# EAGLE design RevisionA (EAGLE 9.1.3)

## Sheet 1 of 2
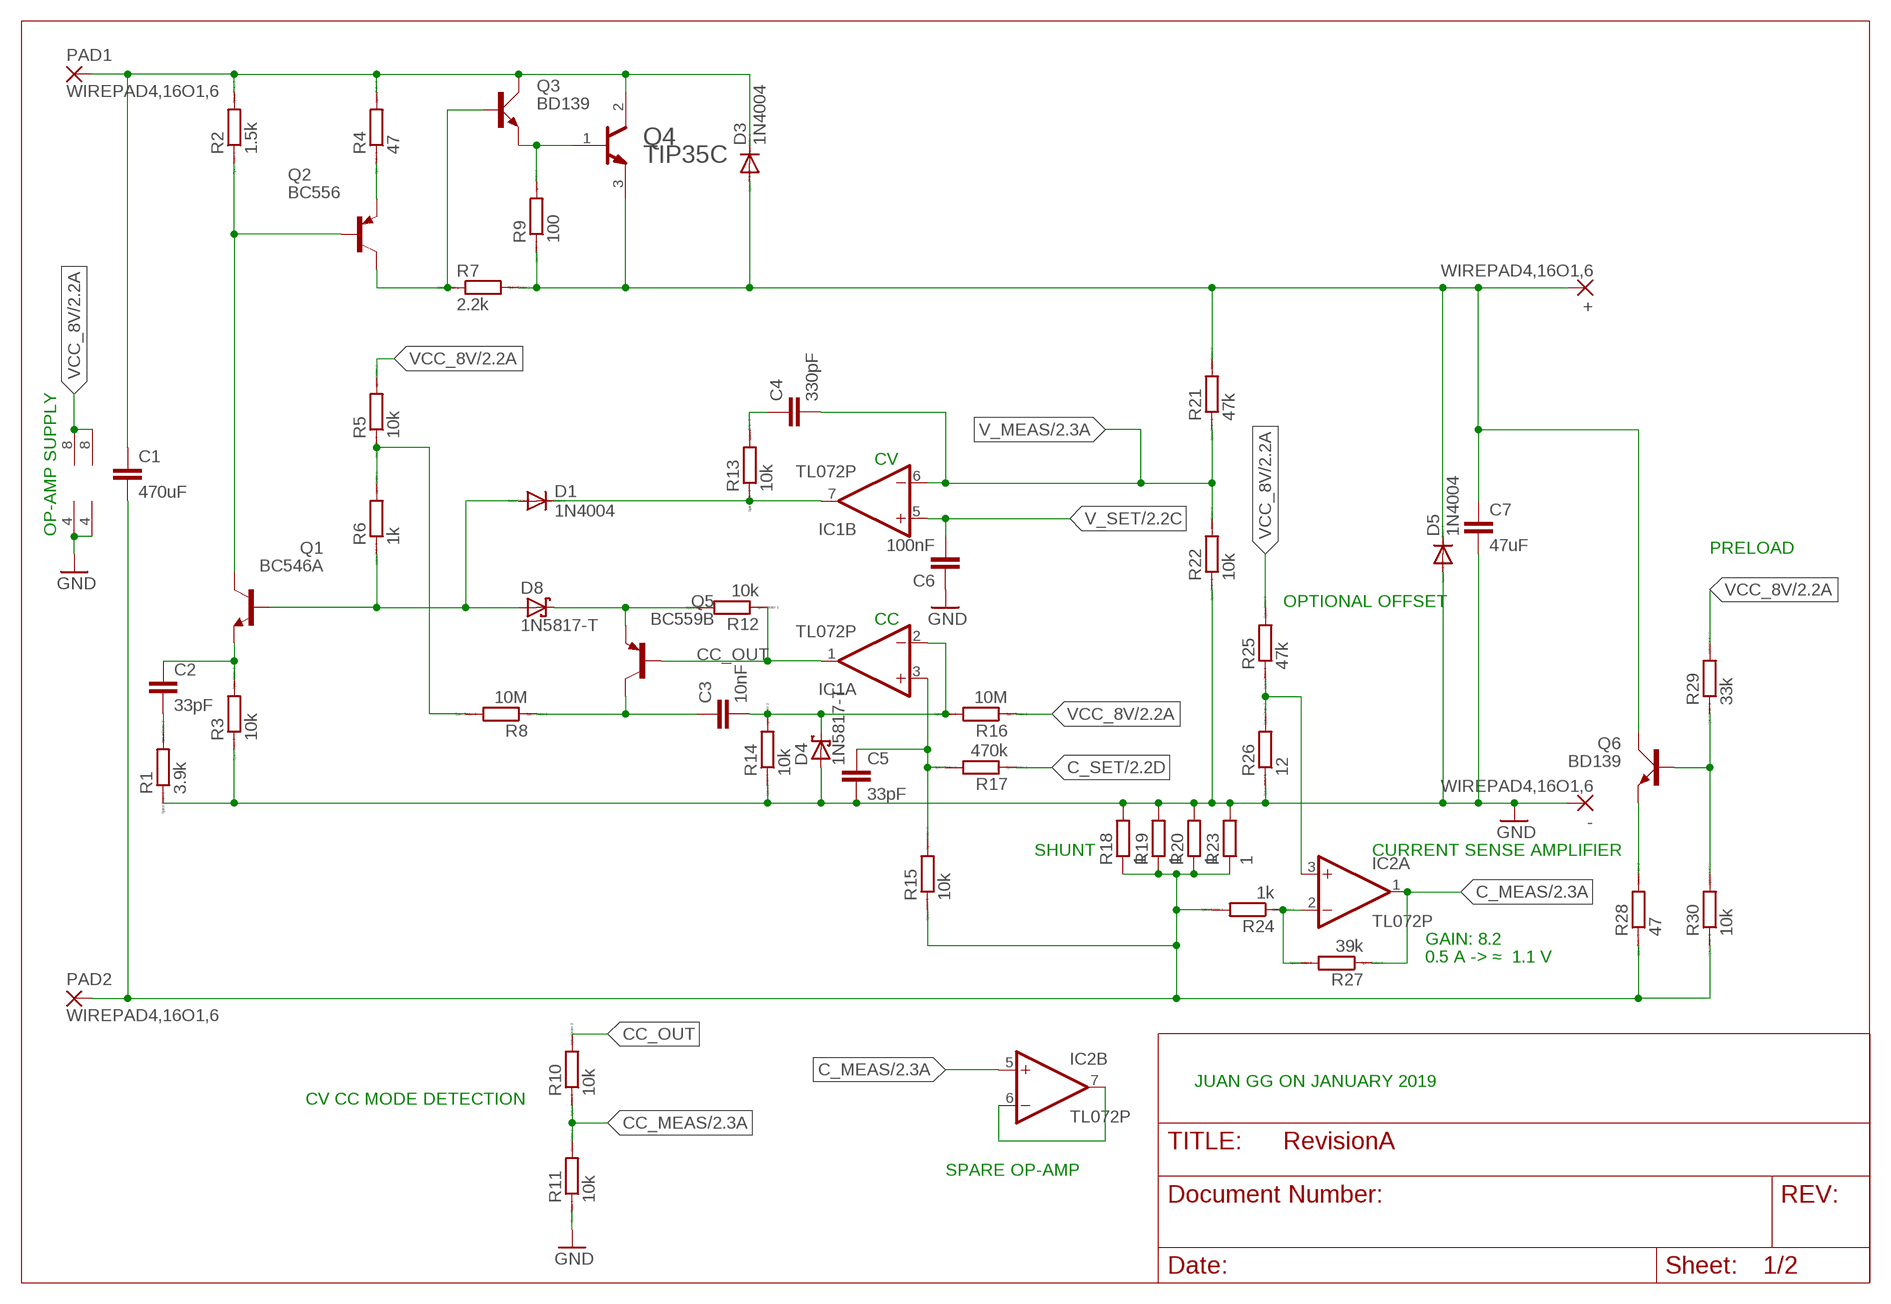
[diagram p0: schematic, sheet 1]

### Parts
+  WIREPAD4,16O1,6  [4,16O1,6]
-  WIREPAD4,16O1,6  [4,16O1,6]
C1  470uF  C5/7.2  [C5B7.2]
C2  33pF  C2.5/2  [C2.5-2]
C3  10nF  C2.5/2  [C2.5-2]
C4  330pF  C2.5/2  [C2.5-2]
C5  33pF  C2.5/2  [C2.5-2]
C6  100nF  C2.5/2  [C2.5-2]
C7  47uF  C5/7.2  [C5B7.2]
D1  1N4004  [DO41-10]
D3  1N4004  [DO41-10]
D4  1N5817-T  [DO41-7.6]
D5  1N4004  [DO41-10]
D8  1N5817-T  [DO41-7.6]
IC1  TL072P  [DIL08]
IC2  TL072P  [DIL08]
PAD1  WIREPAD4,16O1,6  [4,16O1,6]
PAD2  WIREPAD4,16O1,6  [4,16O1,6]
Q1  BC546A  [TO92-EBC]
Q2  BC556  [TO92-EBC]
Q3  BD139  [TO126AV]
Q4  STMICROELECTRONICS_TIP35CSTMICROELECTRONICS_TIP35C_0_0  [STMICROELECTRONICS_TIP35C_0]
Q5  BC559B  [TO92-EBC]
Q6  BD139  [TO126AV]
R1  3.9k  R0207/10  [0207/10]
R2  1.5k  R0207/10  [0207/10]
R3  10k  R0207/10  [0207/10]
R4  47  R0207/10  [0207/10]
R5  10k  R0207/10  [0207/10]
R6  1k  R0207/10  [0207/10]
R7  2.2k  R0207/10  [0207/10]
R8  10M  R0207/10  [0207/10]
R9  100  R0207/10  [0207/10]
R10  10k  R0207/10  [0207/10]
R11  10k  R0207/10  [0207/10]
R12  10k  R0207/10  [0207/10]
R13  10k  R0207/10  [0207/10]
R14  10k  R0207/10  [0207/10]
R15  10k  R0207/10  [0207/10]
R16  10M  R0207/10  [0207/10]
R17  470k  R0207/10  [0207/10]
R18  1  R-EU_0617/5V  [0617V]
R19  1  R-EU_0617/5V  [0617V]
R20  1  R-EU_0617/5V  [0617V]
R21  47k  R0207/10  [0207/10]
R22  10k  R0207/10  [0207/10]
R23  1  R-EU_0617/5V  [0617V]
R24  1k  R0207/10  [0207/10]
R25  47k  R0207/10  [0207/10]
R26  12  R0207/10  [0207/10]
R27  39k  R0207/10  [0207/10]
R28  47  R0207/10  [0207/10]
R29  33k  R0207/10  [0207/10]
R30  10k  R0207/10  [0207/10]

### Nets
+UNREG(MAIN) [POWER]: C1.1 D3.C PAD1.1(P) Q3.C Q4.2(COLLECTOR) R2.2 R4.2
-UNREG(MAIN) [POWER]: C1.2 PAD2.1(P) R15.1 R18.1 R19.1 R20.1 R23.1 R24.2 R28.1 R30.1
C_MEAS: IC2.1(A:OUT) IC2.5(B:+IN) R27.1 ; also sheet 2
C_SET: R17.1 ; also sheet 2
CC_MEAS: R10.1 R11.2 ; also sheet 2
CC_OUT: IC1.1(A:OUT) Q5.B R10.2 R12.1
GND: -.1(P) C5.2 C6.1 C7.2 D4.A D5.A IC1.4(P:V-) IC2.4(P:V-) R1.1 R3.1 R11.1 R14.1 R18.2 R19.2 R20.2 R22.1 R23.2 R26.1 ; also sheet 2
N$2: Q3.E Q4.1(BASE) R9.2
N$3 [POWER]: +.1(P) C7.1 D3.A D5.C Q4.3(EMITTER) Q6.C R7.2 R9.1 R21.2
N$4: Q2.C Q3.B R7.1
N$5: Q2.E R4.1
N$6: Q1.C Q2.B R2.1
N$7: R5.1 R6.2 R8.2
N$8: D1.A D8.A Q1.B R6.1
N$9: C2.1 Q1.E R3.2
N$10: C2.2 R1.2
N$12: D8.C Q5.E R12.2
N$13: C3.2 D4.C IC1.2(A:-IN) R14.2 R16.2
N$14: C3.1 Q5.C R8.1
N$17: C5.1 IC1.3(A:+IN) R15.2 R17.2
N$18: D1.C IC1.7(B:OUT) R13.1
N$19: C4.1 R13.2
N$21: Q6.E R28.2
N$22: Q6.B R29.1 R30.2
N$24: IC2.2(A:-IN) R24.1 R27.2
N$25: IC2.6(B:-IN) IC2.7(B:OUT)
N$26: IC2.3(A:+IN) R25.1 R26.2
V_MEAS: C4.2 IC1.6(B:-IN) R21.1 R22.2 ; also sheet 2
V_SET: C6.2 IC1.5(B:+IN) ; also sheet 2
VCC_8V: IC1.8(P:V+) IC2.8(P:V+) R5.2 R16.1 R25.2 R29.2 ; also sheet 2

### Notes on the sheet
- CV
- OP-AMP SUPPLY
- PRELOAD
- OPTIONAL OFFSET
- CC
- SHUNT | CURRENT SENSE AMPLIFIER
- GAIN: 8.2
- 0.5 A -> ≈  1.1 V
- JUAN GG ON JANUARY 2019
- CV CC MODE DETECTION
- SPARE OP-AMP

## Sheet 2 of 2
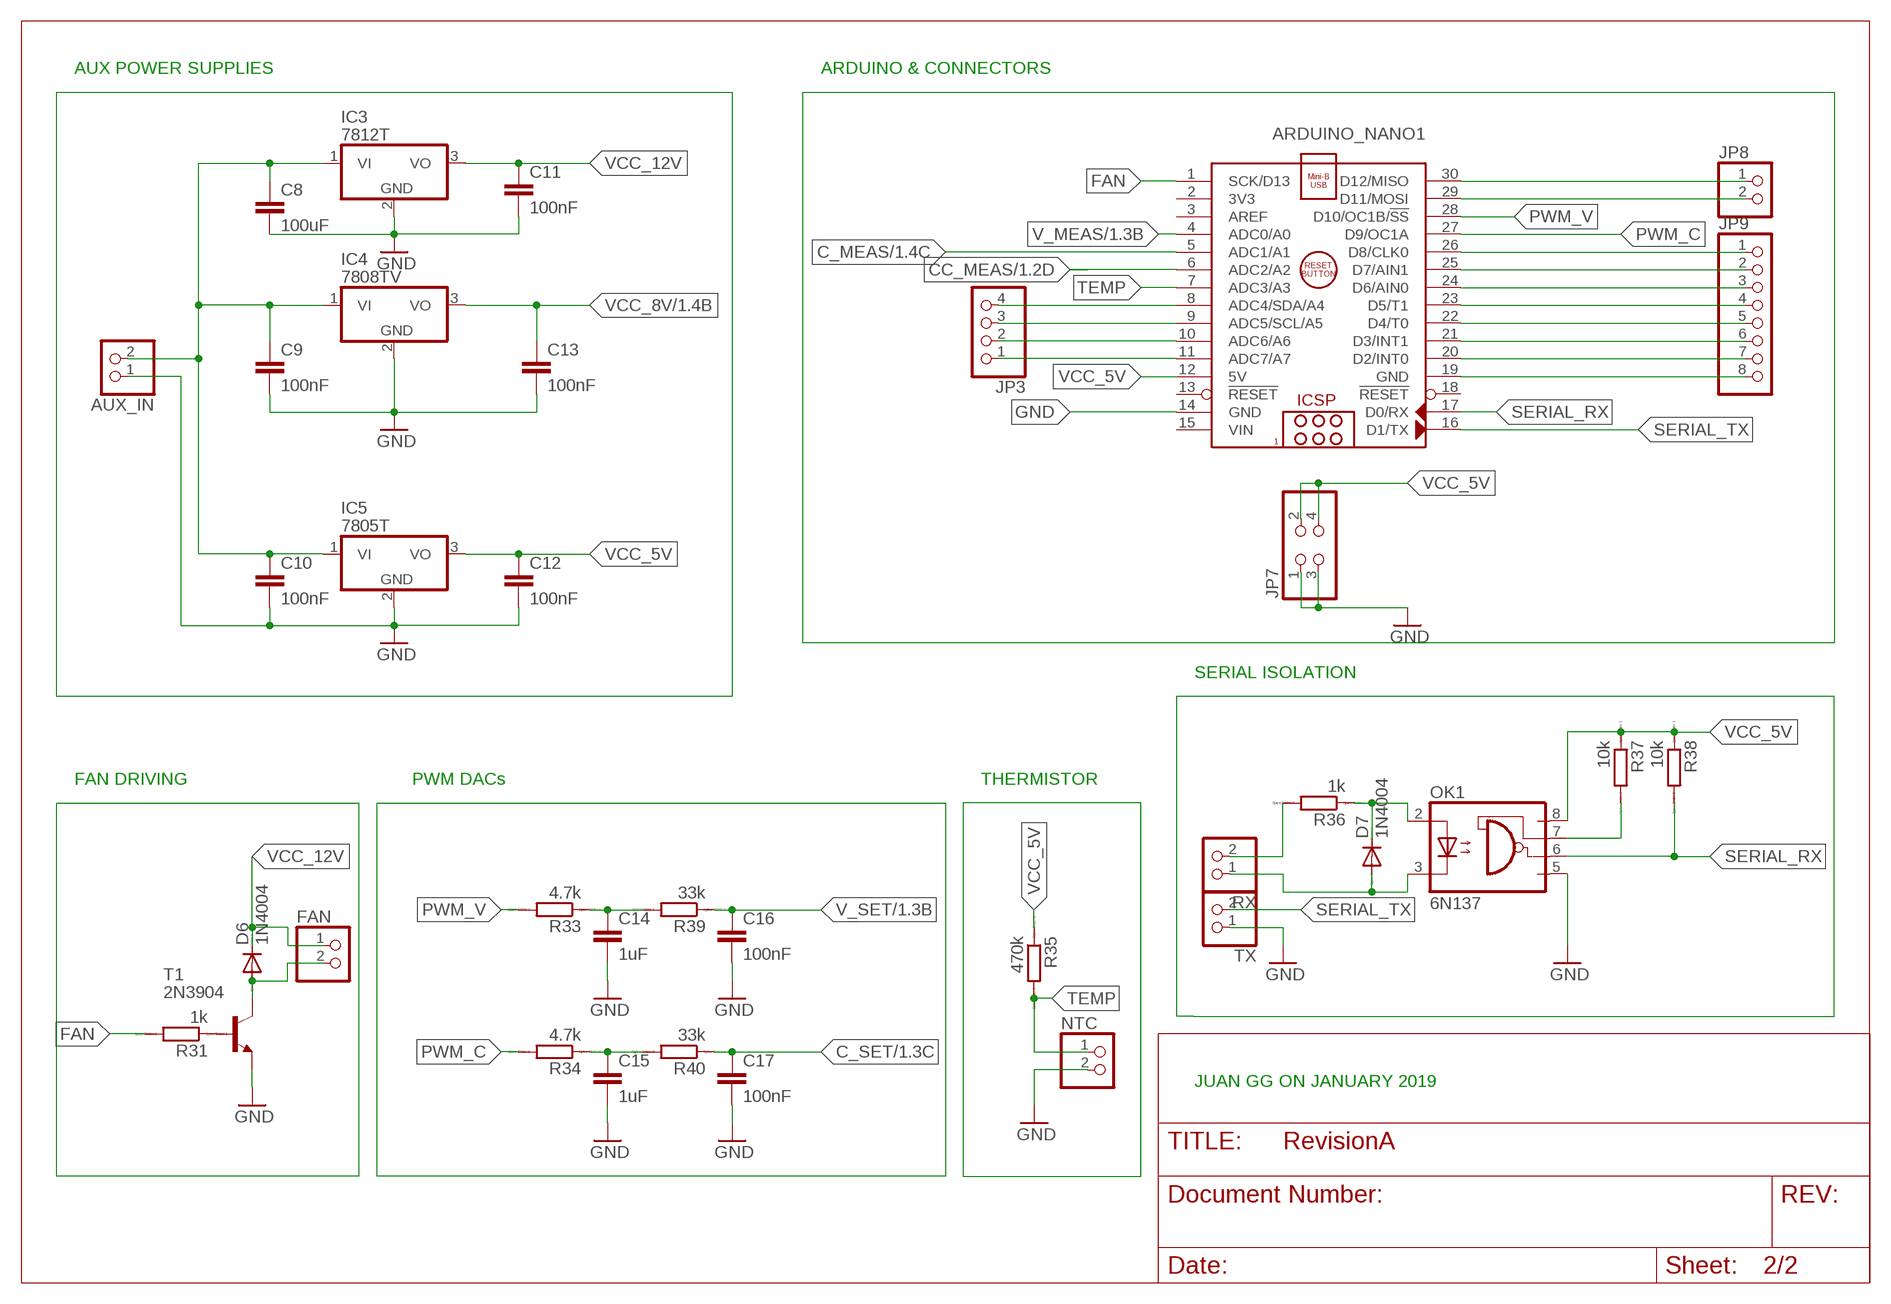
[diagram p1: schematic, sheet 2]
FRAME2 (DINA4_L): TEST: test

### Parts
ARDUINO_NANO1  ARDUINO_NANO  [ARDUINO_NANO]
AUX_IN  PINHD-1X2  [1X02]
C8  100uF  C2.5/4  [C2.5-4]
C9  100nF  C2.5/2  [C2.5-2]
C10  100nF  C2.5/2  [C2.5-2]
C11  100nF  C2.5/2  [C2.5-2]
C12  100nF  C2.5/2  [C2.5-2]
C13  100nF  C2.5/2  [C2.5-2]
C14  1uF  C2.5/4  [C2.5-4]
C15  1uF  C2.5/4  [C2.5-4]
C16  100nF  C2.5/4  [C2.5-4]
C17  100nF  C2.5/4  [C2.5-4]
D6  1N4004  [DO41-10]
D7  1N4004  [DO41-10]
FAN  PINHD-1X2  [1X02]
IC3  7812T  [TO220H]
IC4  7808TV  7812T  [TO220H]
IC5  7805T  [TO220H]
JP3  PINHD-1X4  [1X04]
JP7  PINHD-2X2  [2X02]
JP8  PINHD-1X2  [1X02]
JP9  PINHD-1X8  [1X08]
NTC  PINHD-1X2  [1X02]
OK1  6N137  [DIL08]
R31  1k  R0207/10  [0207/10]
R33  4.7k  R0207/10  [0207/10]
R34  4.7k  R0207/10  [0207/10]
R35  470k  R0207/10  [0207/10]
R36  1k  R0207/10  [0207/10]
R37  10k  R0207/10  [0207/10]
R38  10k  R0207/10  [0207/10]
R39  33k  R0207/10  [0207/10]
R40  33k  R0207/10  [0207/10]
RX  PINHD-1X2  [1X02]
T1  2N3904  [TO92]
TX  PINHD-1X2  [1X02]

### Nets
+UNREG(AUX): AUX_IN.2 C8.1 C9.1 C10.1 IC3.1(VI) IC4.1(VI) IC5.1(VI)
A6: ARDUINO_NANO1.10(ADC6/A6) JP3.2
A7: ARDUINO_NANO1.11(ADC7/A7) JP3.1
C_MEAS: ARDUINO_NANO1.5(ADC1/A1) ; also sheet 1
C_SET: C17.1 R40.1 ; also sheet 1
CC_MEAS: ARDUINO_NANO1.6(ADC2/A2) ; also sheet 1
D2: ARDUINO_NANO1.20(D2/INT0) JP9.7
D3: ARDUINO_NANO1.21(D3/INT1) JP9.6
D4: ARDUINO_NANO1.22(D4/T0) JP9.5
D5: ARDUINO_NANO1.23(D5/T1) JP9.4
D6: ARDUINO_NANO1.24(D6/AIN0) JP9.3
D7: ARDUINO_NANO1.25(D7/AIN1) JP9.2
D8: ARDUINO_NANO1.26(D8/CLK0) JP9.1
D11: ARDUINO_NANO1.29(D11/MOSI) JP8.2
D12: ARDUINO_NANO1.30(D12/MISO) JP8.1
FAN: ARDUINO_NANO1.1(SCK/D13) R31.2
GND: ARDUINO_NANO1.14(GND) ARDUINO_NANO1.19(GND) AUX_IN.1 C8.2 C9.2 C10.2 C11.2 C12.2 C13.2 C14.2 C15.2 C16.2 C17.2 IC3.2(GND) IC4.2(GND) IC5.2(GND) JP7.1 JP7.3 JP9.8 NTC.2 OK1.5(GND) T1.3(E) TX.1 ; also sheet 1
N$1: D7.C OK1.2(A) R36.1
N$11: C14.1 R33.1 R39.2
N$23: OK1.7(VE) R37.2
N$27: D6.A FAN.2 T1.1(C)
N$28: R31.1 T1.2(B)
N$30: C15.1 R34.1 R40.2
N$31: R36.2 RX.2
N$32: D7.A OK1.3(C) RX.1
N$34: ARDUINO_NANO1.8(ADC4/SDA/A4) JP3.4
N$39: ARDUINO_NANO1.9(ADC5/SCL/A5) JP3.3
PWM_C: ARDUINO_NANO1.27(D9/OC1A) R34.2
PWM_V: ARDUINO_NANO1.28(D10/OC1B/!SS) R33.2
SERIAL_RX: ARDUINO_NANO1.17(D0/RX) OK1.6(VO) R38.2
SERIAL_TX: ARDUINO_NANO1.16(D1/TX) TX.2
TEMP: ARDUINO_NANO1.7(ADC3/A3) NTC.1 R35.2
V_MEAS: ARDUINO_NANO1.4(ADC0/A0) ; also sheet 1
V_SET: C16.1 R39.1 ; also sheet 1
VCC_5V: ARDUINO_NANO1.12(5V) C12.1 IC5.3(VO) JP7.2 JP7.4 OK1.8(VCC) R35.1 R37.1 R38.1
VCC_8V: C13.1 IC4.3(VO) ; also sheet 1
VCC_12V: C11.1 D6.C FAN.1 IC3.3(VO)
Unconnected: ARDUINO_NANO1.2(3V3) ARDUINO_NANO1.3(AREF) ARDUINO_NANO1.13(!RESET) ARDUINO_NANO1.18(!RESET)

### Notes on the sheet
- AUX POWER SUPPLIES | ARDUINO & CONNECTORS
- SERIAL ISOLATION
- FAN DRIVING | PWM DACs | THERMISTOR
- JUAN GG ON JANUARY 2019

## Power pins joined to a net without a drawn wire
VIN: ARDUINO_NANO1.15(VIN)

## Library data of the parts
+ - PAD1 PAD2 = wirepad:WIREPAD: Wire PAD connect wire on PCB
ARDUINO_NANO1 = ArduinoNanoV30:ARDUINO_NANO: Arduino Nano V3.0 Module Overview: The Arduino Nano is a small, complete, and breadboard-friendly board based on the ATmega328 (Arduino Nano 3.x) or ATmega168 (Arduino Nano 2.x). It has more or less the same functionality of the Arduino Duemilanove, but in a different package. It lacks only a DC power jack, and works with a Mini-B USB cable instead of a standard one. The Nano was designed and is being produced by Gravitech <http://www.gravitech.us/arna30wiatp.html>. General specifications: Item Value Microcontroller Atmel ATmega168 or ATmega328 Operating Voltage (logic level) 5 V Input Voltage (recommended) 7-12 V Input Voltage (limits) 6-20 V Digital I/O Pins 14 (of which 6 provide PWM output) Analog Input Pins 8 DC Current per I/O Pin 40 mA Flash Memory 16 KB (ATmega168) or 32 KB (ATmega328) of which 2 KB used by bootloader SRAM 1 KB (ATmega168) or 2 KB (ATmega328) EEPROM 512 bytes (ATmega168) or 1 KB (ATmega328) Clock Speed 16 MHz Dimensions (Inches) 0.73" x 1.70" Dimensions (mm) 18mm x 45mm Overall height About 9 mm (not including pins) Weigth 5 g Power: The Arduino Nano can be powered via the Mini-B USB connection, 6-20V unregulated external power supply (pin 30), or 5V regulated external power supply (pin 27). The power source is automatically selected to the highest voltage source. Memory: The ATmega168 has 16 KB of flash memory for storing code (of which 2 KB is used for the bootloader); the ATmega328 has 32 KB, (also with 2 KB used for the bootloader). The ATmega168 has 1 KB of SRAM and 512 bytes of EEPROM (which can be read and written with the EEPROM library); the ATmega328 has 2 KB of SRAM and 1 KB of EEPROM. Input and Output: Each of the 14 digital pins on the Nano can be used as an input or output, using pinMode(), digitalWrite(), and digitalRead() functions. They operate at 5 volts. Each pin can provide or receive a maximum of 40 mA and has an internal pull-up resistor (disconnected by default) of 20-50 kOhms. In addition, some pins have specialized functions. Visit Arduino - ArduinoBoardNano <https://www.arduino.cc/en/Main/ArduinoBoardNano>
AUX_IN FAN JP8 NTC RX TX = pinhead:PINHD-1X2: PIN HEADER
C1-C17 = capacitor-wima:C: CAPACITOR naming: grid - package width
D1 D3 D5-D7 = diode:1N4004: DIODE general purpose rectifier, 1 A
D4 D8 = diode:1N581*: 1.0A SCHOTTKY BARRIER RECTIFIER Source: http://www.diodes.com/datasheets/ds23001.pdf
IC1 IC2 = linear:TL072: OP AMP
IC3-IC5 = linear:78*: Positive VOLTAGE REGULATOR Source: http://cache.national.com/ds/LM/LM78L05.pdf http://www.fairchildsemi.com/ds/LM/LM7805.pdf
JP3 = pinhead:PINHD-1X4: PIN HEADER
JP7 = pinhead:PINHD-2X2: PIN HEADER
JP9 = pinhead:PINHD-1X8: PIN HEADER
OK1 = optocoupler:6N137: MOTOROLA OPTO COUPLER; MPN: 6N137; OC_FARNELL: 1328376; OC_NEWARK: 52M1895
Q1 = transistor-npn:BC546*: NPN Transistor
Q2 = transistor-pnp:BC556*: PNP Transistror
Q3 Q6 = transistor-power:BD139: NPN TRANSISTOR
Q4 = TIP35C:STMICROELECTRONICS_TIP35C: Complementary power transistors; CENTROID_NOT_SPECIFIED: No; DATASHEET: http://www.st.com/content/ccc/resource/technical/document/datasheet/81/78/4f/8c/28/81/4d/c1/CD00001165.pdf/files/CD00001165.pdf/jcr:content/translations/en.CD00001165.pdf; DIGIKEY_DESCRIPTION: TRANS NPN 100V 25A TO-247; DIGIKEY_PART_NUMBER: 497-2609-5-ND; IPC_LAND_PATTERN_NAME: TO-220; LEAD_FREE: yes; MF: STMicroelectronics; MOUSER_PART_NUMBER: 511-TIP35C; MPN: TIP35C; PACKAGE: TO247; PREFIX: Q; ROHS: yes; TEMPERATURE_RANGE_HIGH: +150°C; VOLTAGE: 100V
Q5 = transistor-pnp:BC559*: PNP Transistror
R1-R17 R21 R22 R24-R31 R33-R40 = eagle-ltspice:R: RESISTOR, European symbol; SPICEMODEL: NONE; SPICEPREFIX: R
R18-R20 R23 = resistor:R-EU_: RESISTOR, European symbol
T1 = transistor:2N3904: NPN TRANSISTOR

## Net classes
1 POWER: clearance 0.508 mm

## Board
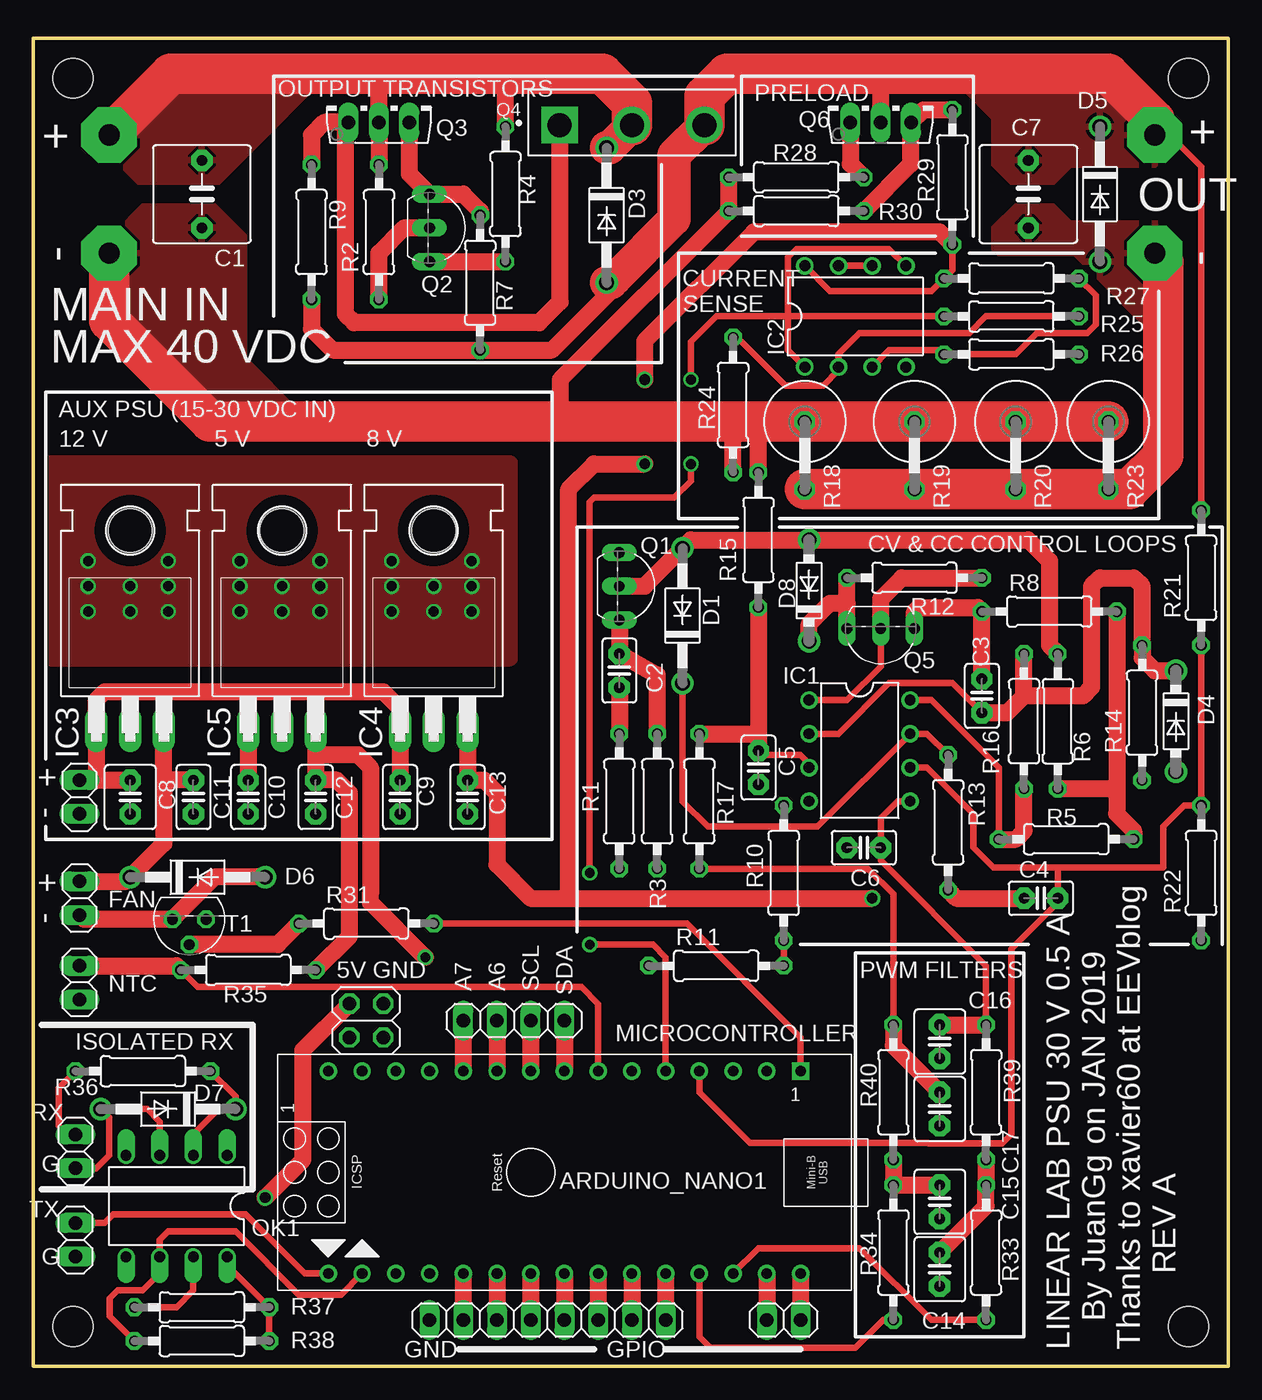
[diagram p2: board, top side]
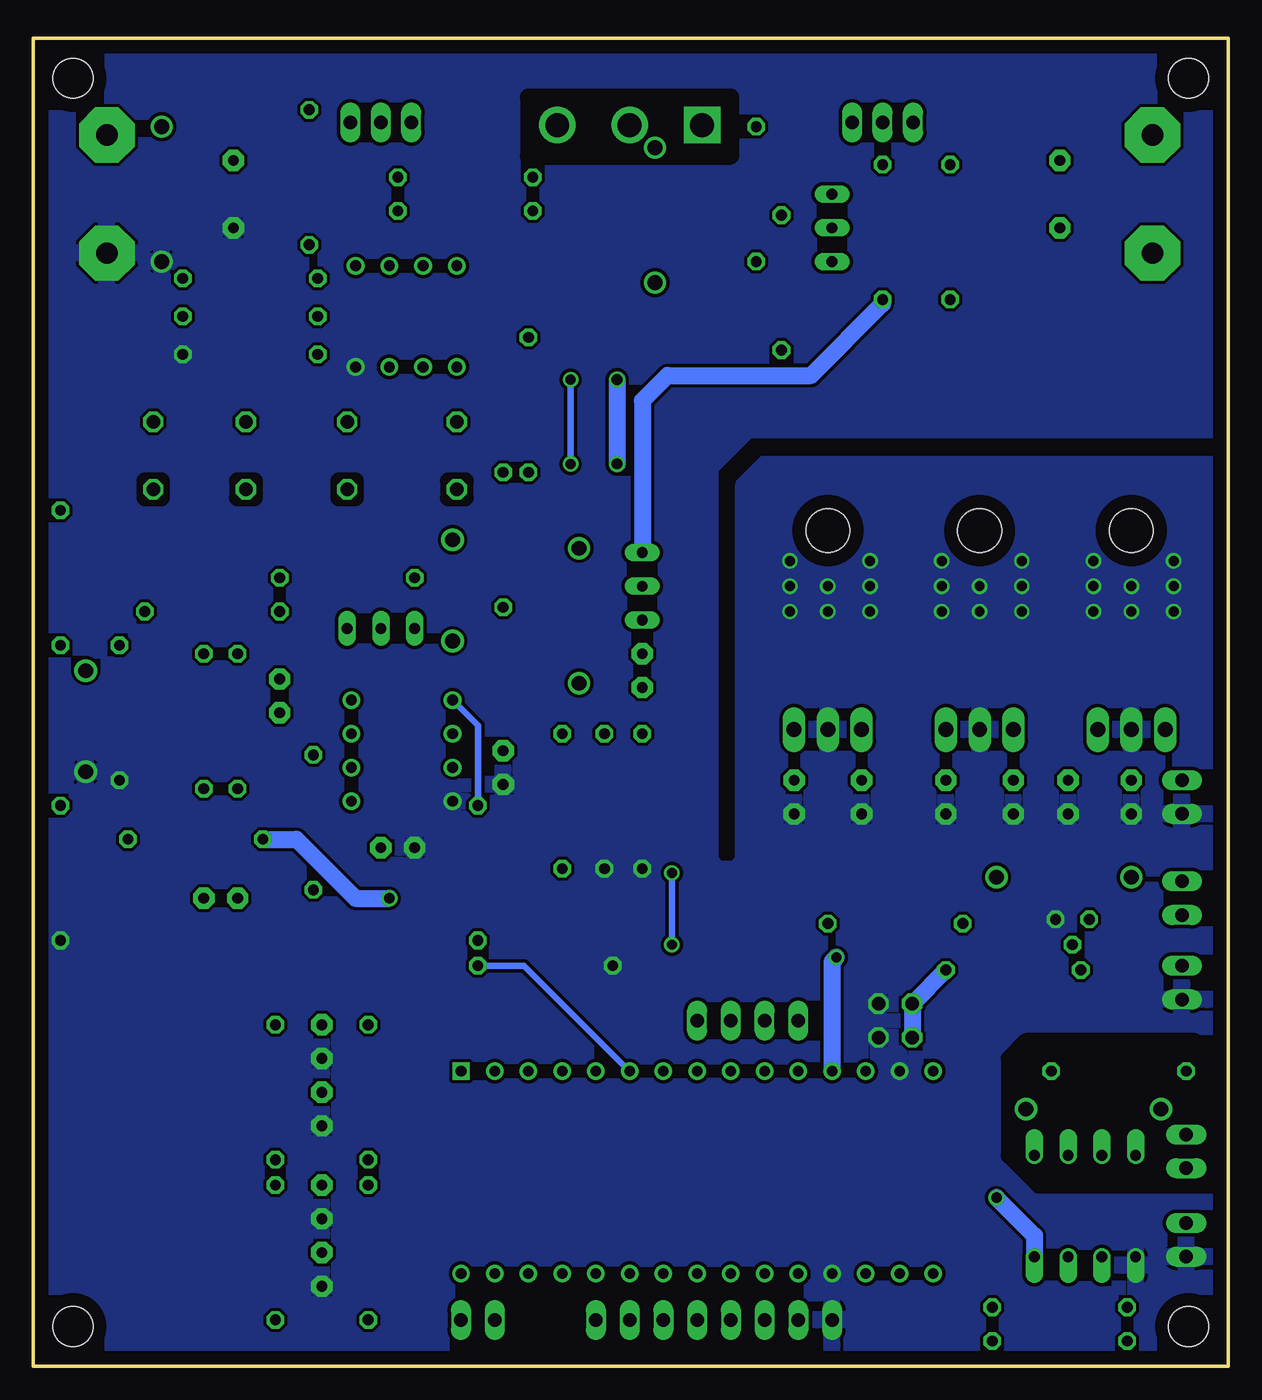
[diagram p3: board, bottom side, seen from below]

Size 90 x 100 mm. Coordinates in mm from the lower left corner, seen from the top.
Outline: 0,100 0,0 90,0 90,100 0,100
Copper layers (1*16): Top 0.035mm / dielectric 1.5mm / Bottom 0.035mm
Design rules "default *": minimum track width 6mil, minimum drill 0.35mm, track to track 10mil, track to pad 10mil, pad to pad 10mil, via to via 10mil, smd to smd 6mil, copper to edge 40mil, drill to drill 6mil, minimum pad ring 10mil, minimum via ring 8mil, stop-mask expansion 4mil, vias tented up to drill 0mil, thermal gap 10mil
Holes 3 mm at 3,3 87,3 87,97 3,97
bRestrict: area 37.5,91.1 to 52.7,95.6; area 57.5,65.4 to 58.7,66.7; area 65.7,65.4 to 67,66.7; area 73.3,65.4 to 74.6,66.7; area 80.3,65.4 to 81.6,66.7; area 1.9,13.7 to 16.5,24.4

### Footprints (pad centres in the part's own frame; a part is rotated, then mirrored left to right if it is on the bottom)
4,16O1,6 = drill 1.6 pad 4.166 octagon: 1 0,0
ARDUINO_NANO = drill 0.8 square: 1 -20.32,-7.62 | drill 0.8: 2 -17.78,-7.62; 3 -15.24,-7.62; 4 -12.7,-7.62; 5 -10.16,-7.62; 6 -7.62,-7.62; 7 -5.08,-7.62; 8 -2.54,-7.62; 9 0,-7.62; 10 2.54,-7.62; 11 5.08,-7.62; 12 7.62,-7.62; 13 10.16,-7.62; 14 12.7,-7.62; 15 15.24,-7.62; 16 15.24,7.62; 17 12.7,7.62; 18 10.16,7.62; 19 7.62,7.62; 20 5.08,7.62; 21 2.54,7.62; 22 0,7.62; 23 -2.54,7.62; 24 -5.08,7.62; 25 -7.62,7.62; 26 -10.16,7.62; 27 -12.7,7.62; 28 -15.24,7.62; 29 -17.78,7.62; 30 -20.32,7.62
1X02 = drill 1.016 long: 1 -1.27,0; 2 1.27,0
C5B7.2 = drill 0.813 pad 1.6 octagon: 1 -2.54,0; 2 2.54,0
C2.5-2 = drill 0.813 pad 1.6 octagon: 1 -1.27,0; 2 1.27,0
C2.5-4 = drill 0.813 pad 1.6 octagon: 1 -1.27,0; 2 1.27,0
DO41-10 = drill 1.118: A 5.08,0; C -5.08,0
DO41-7.6 = drill 1.1 pad 1.7: A 3.81,0; C -3.81,0
DIL08 = drill 0.813 pad 1.27: 1 -3.81,-3.81; 2 -1.27,-3.81; 3 1.27,-3.81; 4 3.81,-3.81; 5 3.81,3.81; 6 1.27,3.81; 7 -1.27,3.81; 8 -3.81,3.81
TO220H = drill 1.118 long: 1 -2.54,-10.16; 2 0,-10.16; 3 2.54,-10.16 | hole 3.302: 0,4.826
1X04 = drill 1.016 long: 1 -3.81,0; 2 -1.27,0; 3 1.27,0; 4 3.81,0
2X02 = drill 1.016 octagon: 1 -1.27,-1.27; 2 -1.27,1.27; 3 1.27,-1.27; 4 1.27,1.27
1X08 = drill 1.016 long: 1 -8.89,0; 2 -6.35,0; 3 -3.81,0; 4 -1.27,0; 5 1.27,0; 6 3.81,0; 7 6.35,0; 8 8.89,0
DIL08' = drill 0.813 offset: 1 -3.81,-3.81; 2 -1.27,-3.81; 3 1.27,-3.81; 4 3.81,-3.81; 5 3.81,3.81; 6 1.27,3.81; 7 -1.27,3.81; 8 -3.81,3.81
TO92-EBC = drill 0.813 long: B 0,-1.27; C -2.54,-1.27; E 2.54,-1.27
TO126AV = drill 1.016 long: B 2.286,-1.27; C 0,-1.27; E -2.286,-1.27
STMICROELECTRONICS_TIP35C_0 = drill 1.8 pad 2.75 square: 1 -0.2,5.45 | drill 1.8 pad 2.75: 2 -0.2,0; 3 -0.2,-5.45
0207/10 = drill 0.813 octagon: 1 -5.08,0; 2 5.08,0
0617V = drill 1.016 octagon: 1 -2.54,0; 2 2.54,0
TO92 = drill 0.813 octagon: 1 1.27,0; 2 0,1.905; 3 -1.27,0

### Placement (x,y rotation side)
+  84.45,92.71 0 top
-  84.45,83.82 0 top
ARDUINO_NANO1  37.47,14.61 180 top
AUX_IN  3.49,42.86 90 top
C1  12.7,88.27 270 top
C2  44.13,52.39 270 top
C3  71.44,50.48 270 top
C4  75.88,35.24 0 top
C5  54.61,45.09 270 top
C6  62.55,39.05 0 top
C7  74.93,88.27 270 top
C8  7.3,42.86 270 top
C9  27.62,42.86 270 top
C10  16.19,42.86 270 top
C11  12.06,42.86 270 top
C12  21.27,42.86 270 top
C13  32.7,42.86 270 top
C14  68.26,7.3 270 top
C15  68.26,12.38 270 top
C16  68.26,24.45 270 top
C17  68.26,19.37 270 top
D1  48.9,56.52 90 top
D3  43.18,86.68 270 top
D4  86.04,48.58 270 top
D5  80.33,88.27 270 top
D6  12.38,36.83 0 top
D7  10.16,19.37 180 top
D8  58.42,58.42 90 top
FAN  3.49,35.24 270 top
IC1  62.23,46.35 270 top
IC2  61.91,79.06 0 top
IC3  7.3,58.1 0 top
IC4  30.16,58.1 0 top
IC5  18.73,58.1 0 top
JP3  36.2,26.04 0 top
JP7  25.08,26.04 90 top
JP8  56.52,3.49 180 top
JP9  38.73,3.49 180 top
NTC  3.49,28.89 270 top
OK1  6N137  [DIL08']  10.79,12.06 180 top
PAD1  5.71,92.71 0 top
PAD2  5.71,83.82 0 top
Q1  45.4,58.74 270 top
Q2  31.11,85.72 270 top
Q3  26.04,94.93 0 top
Q4  45.09,93.66 90 top
Q5  63.82,54.29 180 top
Q6  63.82,94.93 0 top
R1  44.13,42.55 90 top
R2  26.04,85.41 90 top
R3  46.99,42.55 90 top
R4  35.56,88.27 90 top
R5  77.79,39.69 180 top
R6  77.15,48.58 270 top
R7  33.66,81.6 270 top
R8  76.52,56.83 0 top
R9  20.95,85.41 90 top
R10  56.52,37.15 90 top
R11  51.44,30.16 0 top
R12  66.36,59.37 180 top
R13  68.9,40.96 270 top
R14  83.5,49.21 90 top
R15  54.61,62.23 270 top
R16  74.61,48.58 90 top
R17  50.16,42.55 90 top
R18  58.1,68.58 270 top
R19  66.36,68.58 270 top
R20  73.98,68.58 270 top
R21  87.95,59.37 90 top
R22  87.95,37.15 90 top
R23  80.96,68.58 270 top
R24  52.7,72.39 270 top
R25  73.66,81.92 180 top
R26  73.66,76.2 180 top
R27  73.66,79.06 0 top
R28  57.47,89.53 0 top
R29  69.22,89.53 270 top
R30  57.47,87 0 top
R31  25.08,33.34 0 top
R33  71.75,8.57 270 top
R34  64.77,8.57 270 top
R35  16.19,29.84 180 top
R36  8.26,22.23 180 top
R37  12.7,4.45 180 top
R38  12.7,1.91 180 top
R39  71.75,20.64 270 top
R40  64.77,20.64 270 top
RX  3.17,16.19 90 top
T1  11.75,33.66 180 top
TX  3.17,9.53 90 top

### Tracks (layer width: path | path; a pad name or v marks a point on that pad's centre or on a via)
+UNREG(AUX)
  Top 1.27: 16.19,50.8 5.4,50.8 4.76,50.16 IC3.1 4.76,44.13 AUX_IN.2 C8.1 | 16.19,50.8 26.35,50.8 27.62,49.53 IC4.1 C9.1 | C10.1 IC5.1 16.19,50.8
+UNREG(MAIN)
  Top 1.27: R2.2 Q3.C 26.04,97.33 | R4.2 35.56,97.02 35.88,97.33
  Top 2.54: D3.C 43.38,91.76 Q4.2
  Top 3.048: PAD1.1 10.34,97.33 26.04,97.33 35.88,97.33 42.86,97.33 45.09,95.11 Q4.2
  pour Top: 20.32,96.2 11.11,96.2 10.79,96.2
  pour Top: 5.71,92.71 5.71,91.44 7.62,89.53 7.94,89.22 13.97,89.22 15.88,91.12 22.23,97.47 11.75,97.47 11.43,97.79 6.35,92.71
-UNREG(MAIN)
  Top 1.27: R28.1 R30.1 39.69,74.3 39.69,71.12 | 55.56,71.12 54.61,71.12 R15.1 | R24.2 52.7,71.12
  Top 3.048: R23.1 R20.1 R19.1 R18.1 55.56,71.12 52.7,71.12 39.69,71.12 13.34,71.12 5.71,78.74 PAD2.1
  pour Top: 6.35,85.41 8.26,87.31 13.65,87.31 15.88,85.09 15.88,75.88 20,71.75 20,71.44 13.65,71.44 5.71,79.38 5.71,81.28 5.71,84.77
A6
  Top 1.27: JP3.2 ARDUINO_NANO1.10
A7
  Top 1.27: JP3.1 ARDUINO_NANO1.11
C_MEAS  (via drill 0.75)
  Top 0.508: R27.1 56.83,79.06 | 56.83,79.06 56.83,79.38 56.83,83.5 57.47,84.14 64.45,84.14 IC2.5 | v49.53,74.3 49.53,77.15 51.44,79.06 56.83,79.06 | IC2.1 56.83,76.52 56.83,79.06 | v41.91,37.15 41.91,65.09 42.23,65.41 48.26,65.41 49.53,66.67 v49.53,67.94 | v41.91,31.75 46.67,31.75 47.62,30.8 ARDUINO_NANO1.5
  Bottom 0.508: v41.91,37.15 v41.91,31.75 | v49.53,74.3 v49.53,67.94
C_SET
  Top 0.508: R17.1 62.87,37.47 64.77,35.56 64.77,26.04 R40.1
  Top 1.27: R40.1 64.77,24.13 C17.1
CC_MEAS
  Top 0.508: R10.1 R11.2
  Bottom 0.508: ARDUINO_NANO1.6 53.02,30.16 R11.2
CC_OUT
  Top 0.508: IC1.1 61.28,50.16 63.82,52.7 Q5.B
  Top 1.27: Q5.B 63.82,57.78 65.41,59.37 R12.1
  Bottom 0.508: IC1.1 56.52,48.26 R10.2
D2
  Top 1.27: ARDUINO_NANO1.20 JP9.7
D3
  Top 1.27: ARDUINO_NANO1.21 JP9.6
D4
  Top 1.27: ARDUINO_NANO1.22 JP9.5
D5
  Top 1.27: ARDUINO_NANO1.23 JP9.4
D6
  Top 1.27: ARDUINO_NANO1.24 JP9.3
D7
  Top 1.27: ARDUINO_NANO1.25 JP9.2
D8
  Top 1.27: ARDUINO_NANO1.26 JP9.1
D11
  Top 1.27: ARDUINO_NANO1.29 JP8.2
D12
  Top 1.27: ARDUINO_NANO1.30 JP8.1
FAN
  Top 0.508: R31.2 49.21,33.34 57.78,24.77 ARDUINO_NANO1.1
GND  (via drill 0.75)
  Top 3.048: R18.2 R19.2 R20.2 R23.2 82.55,66.04 85.09,68.58 85.09,83.19 -.1
  other vias: 4.13,60.64 4.13,58.74 4.13,56.83 7.3,56.83 7.3,58.74 10.16,60.64 10.16,58.74 10.16,56.83 15.56,60.64 15.56,58.74 15.56,56.83 18.73,58.74 18.73,56.83 21.59,60.64 21.59,58.74 21.59,56.83 26.99,60.64 26.99,58.74 26.99,56.83 30.16,58.74 30.16,56.83 33.02,60.64 33.02,58.74 33.02,56.83
  pour Bottom: 0.64,64.77 0.64,0.64 89.53,0.64 89.53,99.06 0.64,99.06 0.64,70.48 36.2,70.48 36.83,69.85 39.05,67.63 39.05,39.37 39.05,38.1 38.42,37.47 37.15,37.47 36.51,38.1 36.51,66.36 35.56,67.31 34.92,67.94 0.64,67.94
  pour Top: 1.27,53.34 35.88,53.34 35.88,67.94 1.27,67.94
  pour Top: 85.12,86.04 78.11,86.04 76.83,87.31 73.98,87.31 72.39,85.72 72.39,84.14 72.71,83.82 78.42,83.82 84.77,77.47
N$1
  Top 0.508: R36.1 15.24,20.32 D7.C 13.97,19.37 12.06,17.46 OK1.2
N$2
  Top 1.27: R9.2 20.95,92.71 21.91,93.66 Q3.E 23.5,93.41 23.5,82.87 23.5,79.23 24.15,78.58 38.1,78.58 39.69,80.16 39.69,93.41 Q4.1
N$3
  Top 0.508: R21.2 87.95,90.34 85.58,92.71 +.1
  Top 1.27: R9.1 20.95,78.11 22.54,76.52 R7.2 39.06,76.52 43.81,81.27 43.81,81.92 43.5,81.6 | Q6.C 63.82,97.33
  Top 2.54: Q4.3 48.26,91.19 48.26,86.36 43.81,81.92 | 43.5,81.6 D3.A
  Top 3.048: +.1 84.45,93.83 80.95,97.33 63.82,97.33 52.25,97.33 50.53,95.62 Q4.3
  pour Top: 84.45,90.49 78.11,90.49 77.79,90.17 76.83,89.22 73.66,89.22 72.39,90.49 72.39,93.34 72.39,93.66 72.39,93.98 69.53,96.84 81.92,96.84 84.45,94.3
N$4
  Top 1.27: Q3.B 28.32,89.79 Q2.C 32.38,88.27 33.66,87 R7.1
N$5
  Top 1.27: Q2.E R4.1
N$6
  Top 1.27: R2.1 26.04,83.82 27.94,85.72 Q2.B
  Bottom 1.27: Q1.C 44.13,72.71 42.23,74.61 31.43,74.61 26.04,80.01 R2.1
N$7
  Top 1.27: R8.2 81.6,43.5 | 81.6,43.5 81.6,41.59 82.87,40.32 R5.1 | R6.2 81.6,43.5
N$8
  Top 1.27: Q1.B 46.04,58.74 D1.A 49.53,62.23 D8.A 74.93,62.23 76.52,60.64 76.52,54.29 R6.1
N$9
  Top 1.27: Q1.E C2.1 46.99,52.07 R3.2
N$10
  Top 1.27: C2.2 R1.2
N$11
  Top 1.27: R39.2 R33.1 71.75,12.06 C14.1
N$12
  Top 1.27: D8.C 58.42,55.88 60.01,57.47 61.28,57.47 | 61.28,57.47 R12.2 | Q5.E 61.28,57.47
N$13
  Top 0.508: IC1.2 60.64,47.62 64.45,51.44 69.22,51.44 C3.2
  Top 1.27: D4.C 84.45,52.39 83.5,53.34 R14.2 83.5,58.74 82.87,59.37 80.33,59.37 79.69,58.74 79.69,51.12 79.06,50.48 74.61,50.48 | 74.61,50.48 R16.2 | C3.2 73.34,49.21 74.61,50.48
N$14
  Top 1.27: C3.1 R8.1 71.12,57.15 66.67,57.15 66.36,56.83 Q5.C
N$17
  Top 0.508: C5.1 54.93,46.04 57.78,46.04 58.42,45.4 IC1.3
  Top 1.27: R15.2 C5.1 54.61,47.62 R17.2
N$18
  Top 0.508: D1.C 48.9,42.55 50.8,40.64 59.05,40.64 IC1.7 67.31,47.62 R13.1
N$19
  Top 1.27: R13.2 69.53,35.24 C4.1
N$21
  Top 1.27: Q6.E 61.53,90.55 R28.2
N$22
  Top 1.27: R30.2 66.1,90.55 Q6.B 67.06,94.61 R29.1
N$23
  Top 0.508: OK1.7 12.06,5.71 10.79,4.45 R37.2
N$24
  Top 0.508: R24.1 53.02,77.47 56.63,73.86 59.5,73.86 60.64,75.01 IC2.2 60.64,76.2 62.23,77.79 70.48,77.79 71.75,79.06 R27.2
N$25
  Top 0.508: IC2.7 IC2.6
N$26
  Top 0.508: IC2.3 64.45,76.52 68.26,76.52 R26.2 73.98,76.2 75.56,77.79 79.38,77.79 80.01,78.42 80.01,80.64 R25.1
N$27
  Top 1.27: D6.A 13.65,36.83 T1.1 3.81,33.66 FAN.2
N$28
  Top 1.27: T1.2 18.41,31.75 R31.1
N$30
  Top 1.27: R40.2 R34.1 C15.1
N$31
  Top 0.508: R36.2 1.91,20.95 1.91,19.05 1.91,18.1 2.54,17.46 RX.2
N$32
  Top 0.508: OK1.3 9.53,18.41 8.57,19.37 D7.A 5.71,18.73 5.71,15.88 4.76,14.92 RX.1
N$34
  Top 1.27: JP3.4 ARDUINO_NANO1.8
N$39
  Top 1.27: JP3.3 ARDUINO_NANO1.9
PWM_C
  Top 0.508: ARDUINO_NANO1.27 50.16,2.22 50.99,1.4 61.91,1.4 64.01,3.49 R34.2
PWM_V
  Top 0.508: ARDUINO_NANO1.28 54.61,8.89 62.23,8.89 67.63,3.49 R33.2
SERIAL_RX
  Top 0.508: R38.2 5.77,3.75 5.77,5.13 6.35,5.71 8.26,5.71 9.53,6.99 OK1.6 9.53,9.53 10.16,10.16 15.24,10.16 20,5.4 23.18,5.4 ARDUINO_NANO1.17
SERIAL_TX
  Top 0.508: TX.2 5.4,10.79 6.03,11.43 16,11.43 20.44,6.99 ARDUINO_NANO1.16
TEMP
  Top 0.508: R35.2 12.38,28.57 41.27,28.57 42.55,27.3 ARDUINO_NANO1.7
  Top 1.27: NTC.1 10.79,30.16 R35.2
V_MEAS
  Top 0.508: 77.15,37.55 C4.2 77.15,34.92 73.66,31.43 73.66,17.46 72.99,16.79 67.4,16.79 67.36,16.83 53.98,16.83 50.16,20.64 ARDUINO_NANO1.4 | 77.15,37.55 72.3,37.55 70.8,39.05 70.8,41.59 67.31,45.09 IC1.6 | R21.1 R22.2 86.68,42.23 85.09,40.64 85.09,37.55 77.15,37.55
V_SET
  Top 0.508: IC1.5 65.09,42.55 63.82,41.27 C6.2 63.82,38.1 71.75,30.16 R39.1
  Top 1.27: C16.1 R39.1
VCC_5V  (via drill 0.75, 0.8)
  Top 0.508: R38.1 R37.1 14.61,7.62 OK1.8
  Top 1.27: R35.1 23.81,32.38 23.81,43.18 22.86,44.13 C12.1 21.27,46.04 | JP7.4 20.32,23.81 20.32,15.56 v17.46,12.7 | IC5.3 21.27,46.04 | 21.27,46.04 24.45,46.04 25.4,45.09 25.4,35.56 25.4,34.92 v29.53,30.8
  Bottom 1.27: v17.46,12.7 14.61,9.84 OK1.8 | JP7.2 JP7.4 R35.1 | ARDUINO_NANO1.12 29.84,30.48 v29.53,30.8
VCC_8V  (via drill 0.8)
  Top 0.508: R5.2 72.71,45.09 67.63,50.16 IC1.8 | IC2.8 60.01,80.96 67.63,80.96 R25.2 69.22,82.55 R29.2
  Top 1.27: R5.2 73.98,39.69 74.61,40.32 R16.1 | v46.04,74.3 46.04,77.18 54.27,85.41 68.26,85.41 R29.2 | 40.32,35.24 v63.18,35.24 | 40.32,35.24 40.32,66.04 42.23,67.94 v46.04,67.94 | 40.32,35.24 37.47,35.24 34.92,37.78 34.92,43.18 33.97,44.13 C13.1 IC4.3
  Bottom 1.27: R5.2 70.17,39.69 65.72,35.24 v63.18,35.24 | v46.04,74.3 v46.04,67.94
VCC_12V
  Top 1.27: FAN.1 6.99,36.51 D6.C 9.84,39.37 9.84,44.13 | C11.1 9.84,44.13 | 9.84,44.13 IC3.3

### Text on the board
tPlace: OUTPUT TRANSISTORS | PRELOAD | + | + | OUT | - | - | MAIN IN | CURRENT / SENSE | MAX 40 VDC | AUX PSU (15-30 VDC IN) | 12 V | 5 V | 8 V | CV & CC CONTROL LOOPS | + | - | + | - | 5V GND | PWM FILTERS | A7 | A6 | SCL | SDA | ISOLATED RX | MICROCONTROLLER | G | G | GND | GPIO | LINEAR LAB PSU 30 V 0.5 A / By JuanGg on JAN 2019 / Thanks to xavier60 at EEVblog / REV A